# EAGLE design bypass (EAGLE 9.6.2)
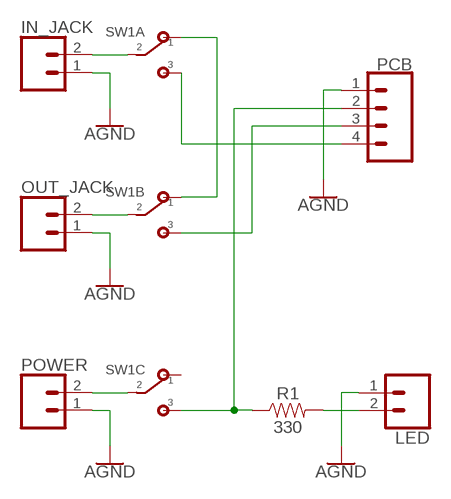
[diagram p0: schematic, sheet 1]

## Parts
IN_JACK  CONN_02POLAR  [MOLEX-1X2]
LED  CONN_02POLAR  [MOLEX-1X2]
OUT_JACK  CONN_02POLAR  [MOLEX-1X2]
PCB  PCB-INOUTPOLAR  [MOLEX-1X4]
POWER  CONN_02POLAR  [MOLEX-1X2]
R1  330  330OHM-HORIZ-1/10W-5%  [AXIAL-0.3]
SW1  3PDT  [3PDT]

## Nets
AGND: IN_JACK.1 LED.1 OUT_JACK.1 PCB.1 POWER.1
N$1: IN_JACK.2 SW1.A2
N$2: OUT_JACK.2 SW1.B2
N$3: SW1.A1 SW1.B1
N$4: PCB.2 R1.P$1 SW1.C3
N$5: PCB.4 SW1.A3
N$6: PCB.3 SW1.B3
N$7: POWER.2 SW1.C2
N$8: LED.2 R1.P$2
Unconnected: SW1.C1

## Library data of the parts
IN_JACK LED OUT_JACK POWER = Custom-Parts:CONN_02: Multi connection point. Often used as Generic Header-pin footprint for 0.1 inch spaced/style header connections On any of the 0.1 inch spaced packages, you can populate with these: Break Away Headers - Straight <https://www.sparkfun.com/products/116> (PRT-00116) Break Away Male Headers - Right Angle <https://www.sparkfun.com/products/553> (PRT-00553) Female Headers <https://www.sparkfun.com/products/115> (PRT-00115) Break Away Headers - Machine Pin <https://www.sparkfun.com/products/117> (PRT-00117) Break Away Female Headers - Swiss Machine Pin <https://www.sparkfun.com/products/743> (PRT-00743) For SCREWTERMINALS and SPRING TERMINALS visit here: Screw Terimnals on SparkFun.com <https://www.sparkfun.com/search/results?term=Screw+Terminals> (5mm/3.5mm/2.54mm spacing) This device is also useful as a general connection point to wire up your design to another part of your project. Our various solder wires solder well into these plated through hole pads. Hook-Up Wire - Assortment (Stranded, 22 AWG) <https://www.sparkfun.com/products/11375> (PRT-11375) Hook-Up Wire - Assortment (Solid Core, 22 AWG) <https://www.sparkfun.com/products/11367> (PRT-11367) View the entire wire category on our website here <https://www.sparkfun.com/categories/141> Special notes: Molex polarized connector foot print use with: PRT-08233 with associated crimp pins and housings. 2.54_SCREWTERM for use with PRT-10571. 3.5mm Screw Terminal footprints for PRT-08084 5mm Screw Terminal footprints for use with PRT-08432; SF_ID: PRT-09918
PCB = Custom-Parts:PCB-INOUT: Multi connection point. Often used as Generic Header-pin footprint for 0.1 inch spaced/style header connections On any of the 0.1 inch spaced packages, you can populate with these: Break Away Headers - Straight <https://www.sparkfun.com/products/116> (PRT-00116) Break Away Male Headers - Right Angle <https://www.sparkfun.com/products/553> (PRT-00553) Female Headers <https://www.sparkfun.com/products/115> (PRT-00115) Break Away Headers - Machine Pin <https://www.sparkfun.com/products/117> (PRT-00117) Break Away Female Headers - Swiss Machine Pin <https://www.sparkfun.com/products/743> (PRT-00743) For SCREWTERMINALS and SPRING TERMINALS visit here: Screw Terimnals on SparkFun.com <https://www.sparkfun.com/search/results?term=Screw+Terminals> (5mm/3.5mm/2.54mm spacing) This device is also useful as a general connection point to wire up your design to another part of your project. Our various solder wires solder well into these plated through hole pads. Hook-Up Wire - Assortment (Stranded, 22 AWG) <https://www.sparkfun.com/products/11375> (PRT-11375) Hook-Up Wire - Assortment (Solid Core, 22 AWG) <https://www.sparkfun.com/products/11367> (PRT-11367) View the entire wire category on our website here <https://www.sparkfun.com/categories/141> Special notes: Molex polarized connector foot print use with SKU : PRT-08231 with associated crimp pins and housings. 1MM SMD Version SKU: PRT-10208; PROD_ID: CONN-08186; SF_ID: PRT-08231
R1 = SparkFun-Resistors:330OHM: 330Ω resistor A resistor is a passive two-terminal electrical component that implements electrical resistance as a circuit element. Resistors act to reduce current flow, and, at the same time, act to lower voltage levels within circuits. - Wikipedia; PROD_ID: RES-8371
SW1 = mb_3pdt:3PDT

## Board
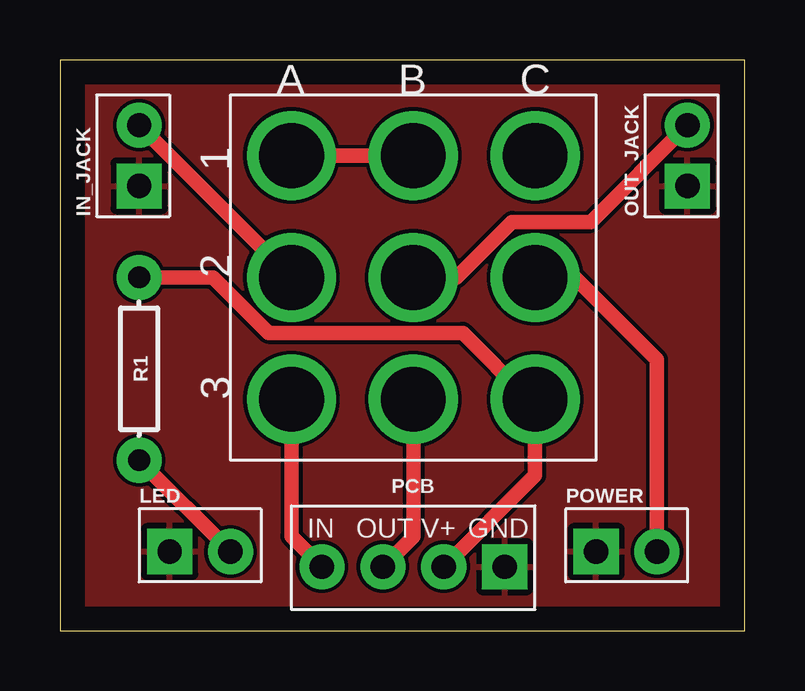
[diagram p1: board, top side]
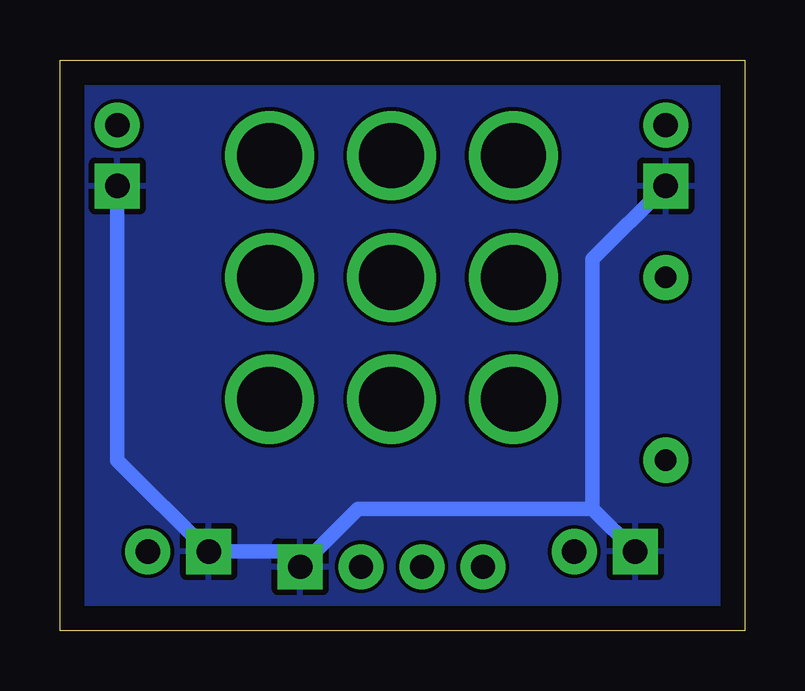
[diagram p2: board, bottom side, seen from below]

Size 28.55 x 23.8 mm. Coordinates in mm from the lower left corner, seen from the top.
Outline: 0,0 28.55,0 28.55,23.8 0,23.8 0,0
Copper layers (1*16): Top 0.035mm / dielectric 1.5mm / Bottom 0.035mm
Design rules "default": minimum track width 6mil, minimum drill 0.35mm, track to track 6mil, track to pad 6mil, pad to pad 6mil, via to via 6mil, smd to smd 6mil, copper to edge 40mil, drill to drill 6mil, minimum pad ring 10mil, minimum via ring 8mil, stop-mask expansion 4mil, vias tented up to drill 0mil, thermal gap 10mil

### Footprints (pad centres in the part's own frame; a part is rotated, then mirrored left to right if it is on the bottom)
MOLEX-1X2 = drill 1.016 pad 1.88 square: 1 0,0 | drill 1.016 pad 1.88: 2 2.54,0
MOLEX-1X4 = drill 1.016 pad 1.88 square: 1 0,0 | drill 1.016 pad 1.88: 2 2.54,0; 3 5.08,0; 4 7.62,0
AXIAL-0.3 = drill 0.9 pad 1.88: P$1 -3.81,0; P$2 3.81,0
3PDT = drill 2.7 pad 1.93: A1 -5.08,5.08; A2 -5.08,0; A3 -5.08,-5.08; B1 0,5.08; B2 0,0; B3 0,-5.08; C1 5.08,5.08; C2 5.08,0; C3 5.08,-5.08

### Placement (x,y rotation side)
IN_JACK  3.3,18.54 90 top
LED  4.57,3.3 0 top
OUT_JACK  26.16,18.54 90 top
PCB  18.54,2.67 180 top
POWER  22.35,3.3 0 top
R1  3.3,10.92 270 top
SW1  14.73,14.73 0 top

### Tracks (layer width: path | path; a pad name or v marks a point on that pad's centre or on a via)
AGND
  Bottom 0.61: OUT_JACK.1 26.16,7.11 POWER.1 19.18,3.3 PCB.1 16.13,5.08 6.35,5.08 | LED.1 6.35,5.08 | IN_JACK.1 6.35,15.49 6.35,5.08
  pour Top: 0,0 28.57,0 28.57,23.5 0,23.5
  pour Bottom: 0,0 28.57,0 28.57,23.5 0,23.5
N$1
  Top 0.61: IN_JACK.2 SW1.A2
N$2
  Top 0.61: SW1.B2 16.54,14.73 18.85,17.05 22.13,17.05 OUT_JACK.2
N$3
  Top 0.61: SW1.A1 SW1.B1
N$4
  Top 0.61: PCB.2 19.81,6.48 SW1.C3 19.56,9.65 16.79,12.42 8.69,12.42 6.38,14.73 R1.P$1
N$5
  Top 0.61: SW1.A3 9.65,3.94 PCB.4
N$6
  Top 0.61: SW1.B3 14.73,3.94 PCB.3
N$7
  Top 0.61: SW1.C2 21.46,14.73 24.89,11.3 POWER.2
N$8
  Top 0.61: R1.P$2 LED.2